# Altium schematic sheet node24-stm32f765bit6.SchDoc: STM32F765BIT6
size Tabloid; Author: Emergence Team; Engineer: asheem; Organization: Emergence; Address1: Oakland, California; Address2: a@aliengeometry.com; Address3: Black Rock City '18; Address4: OPEN SOURCE H/W; DocumentNumber: 2; Revision: Rev 0.1; SheetNumber: 2; SheetTotal: 6; SheetTitle: Node28 Main
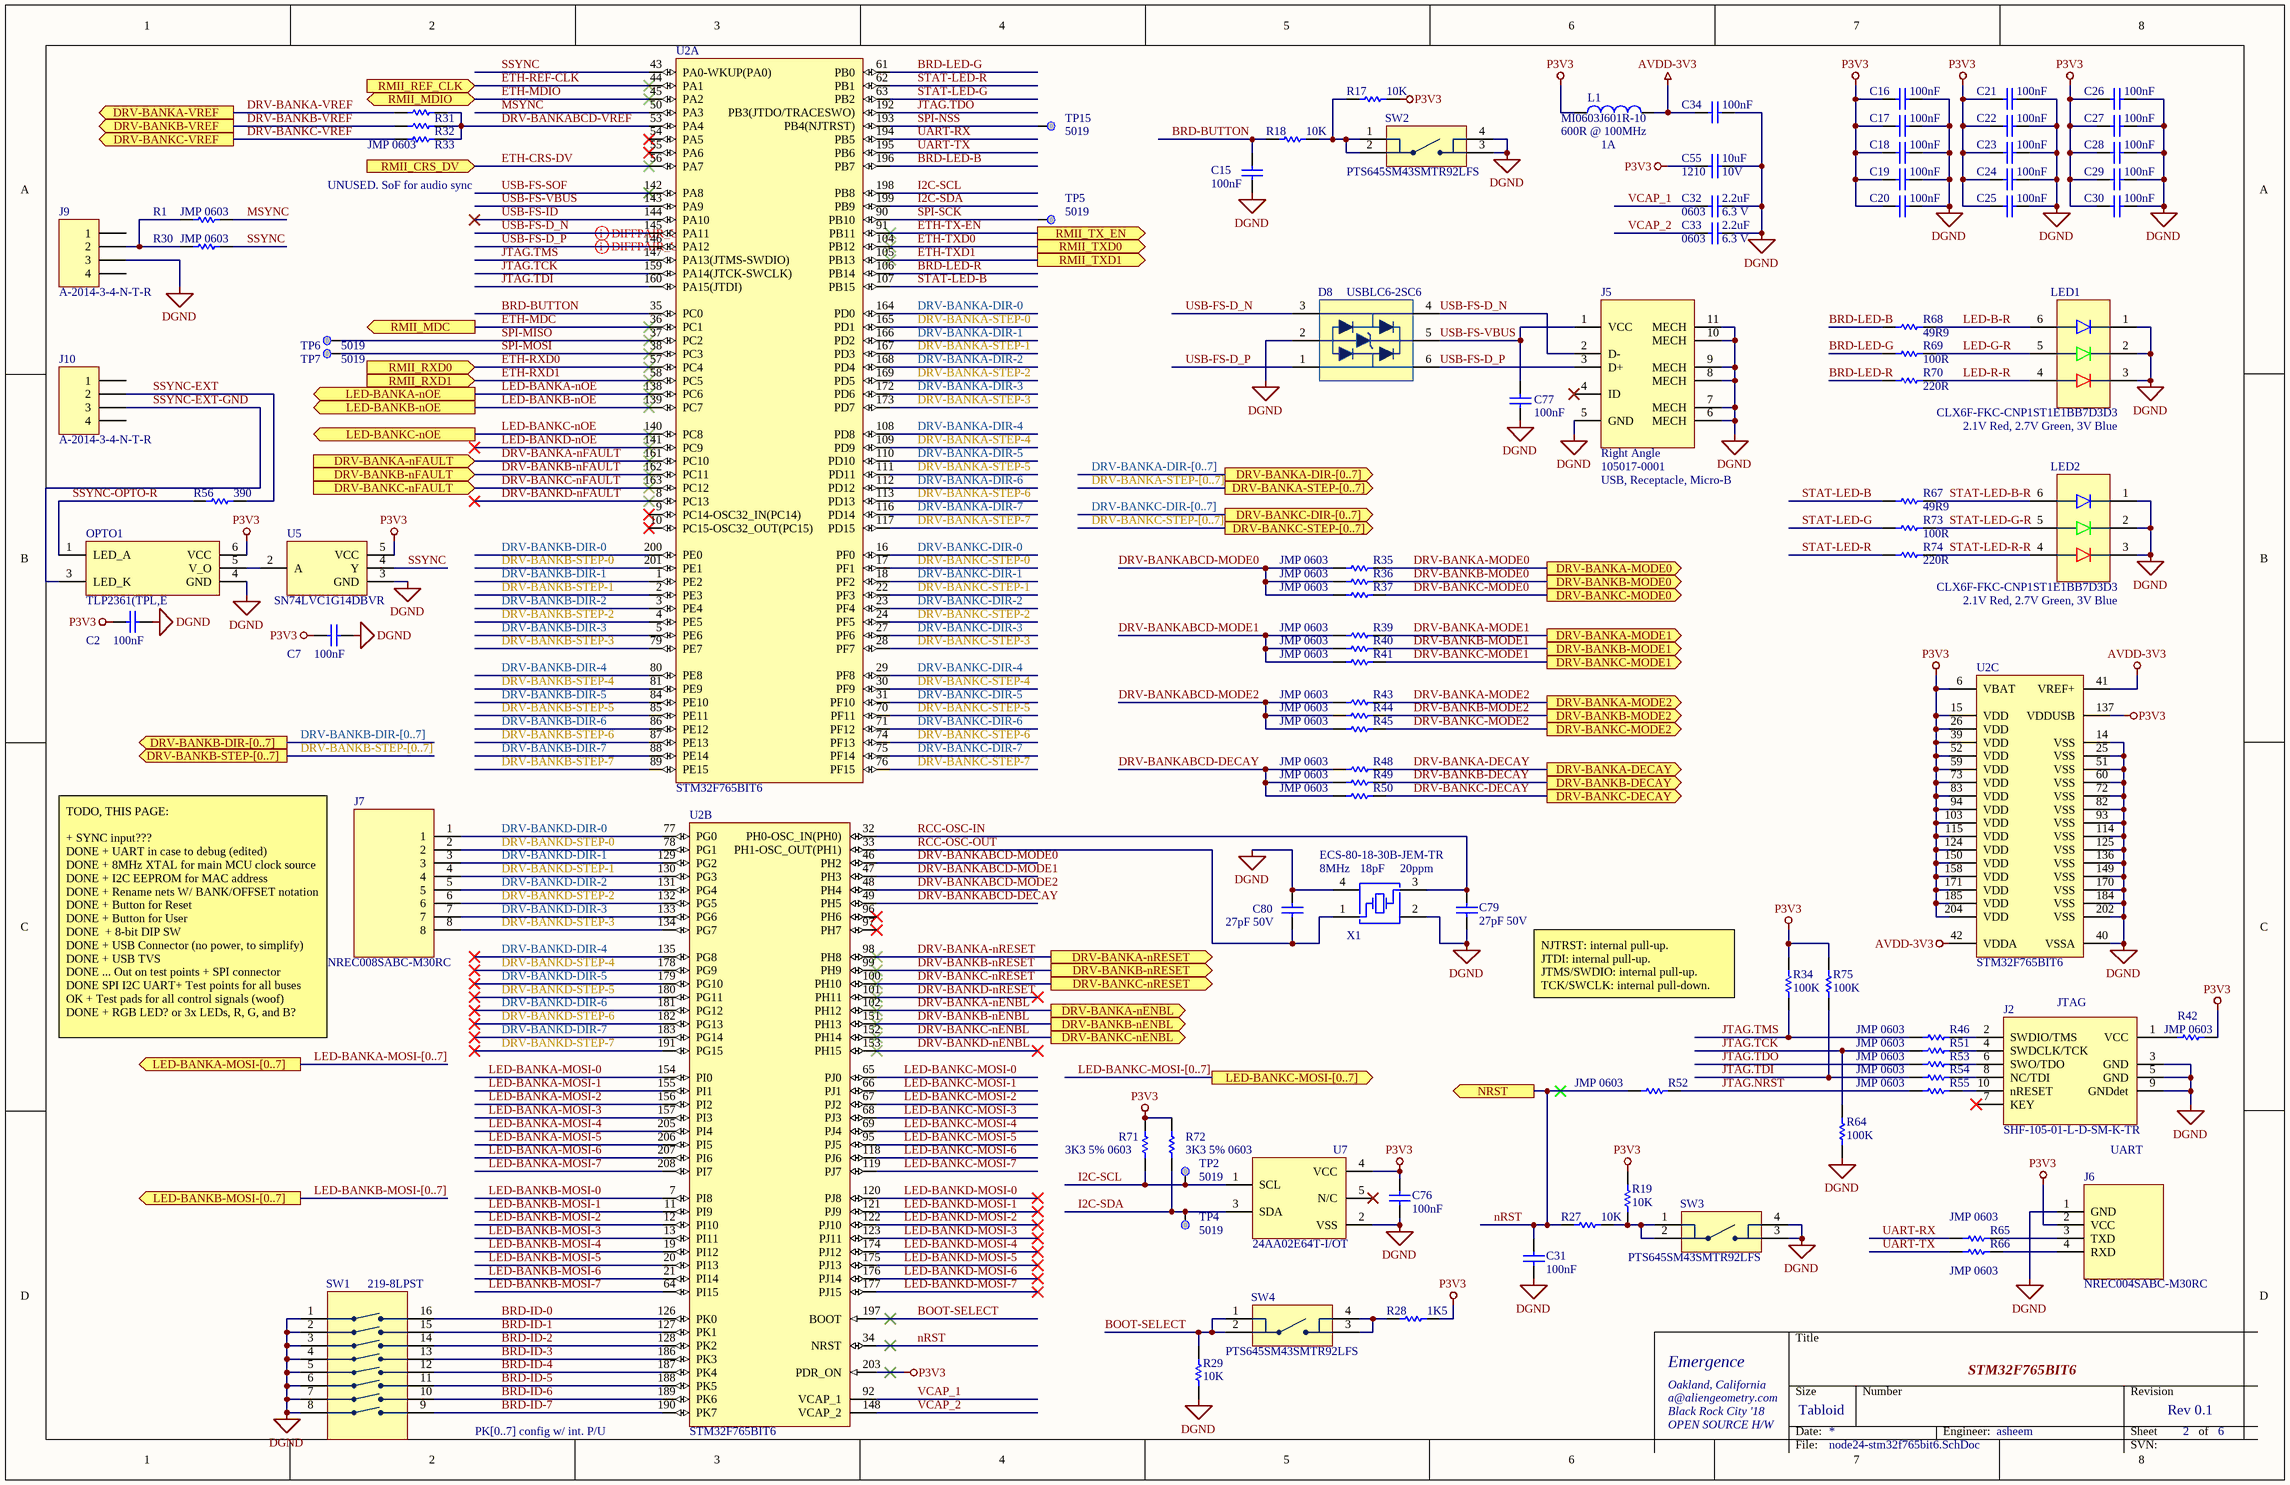
[diagram p0: node24-stm32f765bit6.SchDoc]

## Parts
C2  100nF  [CAPC0603(1608)100_L]
C7  100nF  [CAPC0603(1608)100_L]
C15  100nF  [CAPC0603(1608)100_L]
C16  100nF  [CAPC0603(1608)100_L]
C17  100nF  [CAPC0603(1608)100_L]
C18  100nF  [CAPC0603(1608)100_L]
C19  100nF  [CAPC0603(1608)100_L]
C20  100nF  [CAPC0603(1608)100_L]
C21  100nF  [CAPC0603(1608)100_L]
C22  100nF  [CAPC0603(1608)100_L]
C23  100nF  [CAPC0603(1608)100_L]
C24  100nF  [CAPC0603(1608)100_L]
C25  100nF  [CAPC0603(1608)100_L]
C26  100nF  [CAPC0603(1608)100_L]
C27  100nF  [CAPC0603(1608)100_L]
C28  100nF  [CAPC0603(1608)100_L]
C29  100nF  [CAPC0603(1608)100_L]
C30  100nF  [CAPC0603(1608)100_L]
C31  100nF  [CAPC0603(1608)100_L]
C32  value 2.2uF  Case-EIA: 0603  Rated Voltage: 6.3 V  [CAPC0603(1608)100_M]  (hidden comment: 2.2uF 6.3V)
C33  value 2.2uF  Case-EIA: 0603  Rated Voltage: 6.3 V  [CAPC0603(1608)100_M]  (hidden comment: 2.2uF 6.3V)
C34  100nF  [CAPC0603(1608)100_L]
C55  Capacitance: 10uF  Case/Package: 1210  Voltage Rating: 10V  [1210C]  (hidden comment: CAP_CER_10UF_1210_CL32B106KPINNNE)
C76  100nF  [CAPC0603(1608)100_L]
C77  100nF  [CAPC0603(1608)100_L]
C79  27pF 50V  [CAPC0603(1608)100_L]
C80  27pF 50V  [CAPC0603(1608)100_L]
D8  Manufacturer Part Number: USBLC6-2SC6  [SOT23-6L]  (hidden comment: TVS DIODE 5.25V 17V SOT23-6)
J2  Manufacturer Part Number: SHF-105-01-L-D-SM-K-TR  [CONN_SAMTEC_HDR_50MIL_10POS_SHRD_SM_SHF-105-01-L-D-SM]  (hidden comment: CONN_HDR_2X5_V_M_SM_50MIL_SAMTEC_SHF-105-01-L-D-SM-K-TR)
J5  Orientation: Right Angle  Manufacturer Part Number: 105017-0001  Connector Type: USB, Receptacle, Micro-B  [CONN_MOLEX_USB_MICRO_B_SMD_RA_1050170001]  (hidden comment: CONN_USB_MICRO-B_RA_SMD_MOLEX_105017-0001)
J6  Manufacturer Part Number: NREC004SABC-M30RC  [HDR_1X4_2R54_V_M_SMT]  (hidden comment: CONN_HDR_1X4_V_SMT_NREC004SABC-M30RC)
J7  Manufacturer Part Number: NREC008SABC-M30RC  [HDR_1X8_2R54_V_M_SMT]  (hidden comment: CONN_HDR_1X8_V_M_SMT_NREC008SABC-M30RC)
J9  Manufacturer Part Number: A-2014-3-4-N-T-R  [CON_JACK_MOD_4P4C_ASSMANN_A-2014-3-4-N-T-R]  (hidden comment: CONN_ASSMANN_JACK_MOD_4P4C_A-2014-3-4-N-T-R)
J10  Manufacturer Part Number: A-2014-3-4-N-T-R  [CON_JACK_MOD_4P4C_ASSMANN_A-2014-3-4-N-T-R]  (hidden comment: CONN_ASSMANN_JACK_MOD_4P4C_A-2014-3-4-N-T-R)
L1  Manufacturer Part Number: MI0603J601R-10  Max DC Current: 1A  Impedance: 600R @ 100MHz  [0603L]  (hidden comment: BEAD_LAIRD_MI0603J601R-10)
LED1  Forward Voltage: 2.1V Red, 2.7V Green, 3V Blue  Manufacturer Part Number: CLX6F-FKC-CNP1ST1E1BB7D3D3  [LED_6PLCC_RGB]  (hidden comment: LED_RGB_SMD_CLX6F-FKC-CNP1ST1E1BB7D3D3)
LED2  Forward Voltage: 2.1V Red, 2.7V Green, 3V Blue  Manufacturer Part Number: CLX6F-FKC-CNP1ST1E1BB7D3D3  [LED_6PLCC_RGB]  (hidden comment: LED_RGB_SMD_CLX6F-FKC-CNP1ST1E1BB7D3D3)
OPTO1  Manufacturer Part Number: TLP2361(TPL,E  [SO-5]  (hidden comment: OPTO_TOSHIBA_LOGIC_PUSHPULL_TLP2361(TPL,E)
R1  JMP 0603  [RESC0603(1608)_L]
R17  10K  [RESC0603(1608)_L]
R18  10K  [RESC0603(1608)_L]
R19  10K  [RESC0603(1608)_L]
R27  10K  [RESC0603(1608)_L]
R28  1K5  [RESC0603(1608)_L]
R29  10K  [RESC0603(1608)_L]
R30  JMP 0603  [RESC0603(1608)_L]
R31  JMP 0603  [RESC0603(1608)_L]
R32  JMP 0603  [RESC0603(1608)_L]  (value not drawn)
R33  JMP 0603  [RESC0603(1608)_L]  (value not drawn)
R34  100K  [RESC0603(1608)_L]
R35  JMP 0603  [RESC0603(1608)_L]
R36  JMP 0603  [RESC0603(1608)_L]
R37  JMP 0603  [RESC0603(1608)_L]
R39  JMP 0603  [RESC0603(1608)_L]
R40  JMP 0603  [RESC0603(1608)_L]
R41  JMP 0603  [RESC0603(1608)_L]
R42  JMP 0603  [RESC0603(1608)_L]
R43  JMP 0603  [RESC0603(1608)_L]
R44  JMP 0603  [RESC0603(1608)_L]
R45  JMP 0603  [RESC0603(1608)_L]
R46  JMP 0603  [RESC0603(1608)_L]
R48  JMP 0603  [RESC0603(1608)_L]
R49  JMP 0603  [RESC0603(1608)_L]
R50  JMP 0603  [RESC0603(1608)_L]
R51  JMP 0603  [RESC0603(1608)_L]
R52  JMP 0603  [RESC0603(1608)_L]
R53  JMP 0603  [RESC0603(1608)_L]
R54  JMP 0603  [RESC0603(1608)_L]
R55  JMP 0603  [RESC0603(1608)_L]
R56  value 390  [RESC0603(1608)_L]  (hidden comment: 390R 1% 0603(1608))
R64  100K  [RESC0603(1608)_L]
R65  JMP 0603  [RESC0603(1608)_L]
R66  JMP 0603  [RESC0603(1608)_L]
R67  49R9  [RESC0603(1608)_L]
R68  49R9  [RESC0603(1608)_L]
R69  100R  [RESC0603(1608)_L]
R70  220R  [RESC0603(1608)_L]
R71  3K3 5% 0603  [RESC0603(1608)_L]
R72  3K3 5% 0603  [RESC0603(1608)_L]
R73  100R  [RESC0603(1608)_L]
R74  220R  [RESC0603(1608)_L]
R75  100K  [RESC0603(1608)_L]
SW1  Manufacturer Part Number: 219-8LPST  [SWITCH_DIP_CTS_8-BIT_219-8LPST]  (hidden comment: SWITCH_CTS_DIP_8BIT_SMD_219-8LPST)
SW2  Manufacturer Part Number: PTS645SM43SMTR92LFS  [SWITCH_CK_TACT_PTS645SM43SMTR92]  (hidden comment: SWITCH_CK_TACTILE_SPST_SMD_PTS645SM43SMTR92LFS)
SW3  Manufacturer Part Number: PTS645SM43SMTR92LFS  [SWITCH_CK_TACT_PTS645SM43SMTR92]  (hidden comment: SWITCH_CK_TACTILE_SPST_SMD_PTS645SM43SMTR92LFS)
SW4  Manufacturer Part Number: PTS645SM43SMTR92LFS  [SWITCH_CK_TACT_PTS645SM43SMTR92]  (hidden comment: SWITCH_CK_TACTILE_SPST_SMD_PTS645SM43SMTR92LFS)
TP2  Manufacturer Part Number: 5019  [TEST_POINT_KEYSTONE_5019]  (hidden comment: TEST_POINT_KEYSTONE_5019_SMT)
TP4  Manufacturer Part Number: 5019  [TEST_POINT_KEYSTONE_5019]  (hidden comment: TEST_POINT_KEYSTONE_5019_SMT)
TP5  Manufacturer Part Number: 5019  [TEST_POINT_KEYSTONE_5019]  (hidden comment: TEST_POINT_KEYSTONE_5019_SMT)
TP6  Manufacturer Part Number: 5019  [TEST_POINT_KEYSTONE_5019]  (hidden comment: TEST_POINT_KEYSTONE_5019_SMT)
TP7  Manufacturer Part Number: 5019  [TEST_POINT_KEYSTONE_5019]  (hidden comment: TEST_POINT_KEYSTONE_5019_SMT)
TP15  Manufacturer Part Number: 5019  [TEST_POINT_KEYSTONE_5019]  (hidden comment: TEST_POINT_KEYSTONE_5019_SMT)
U2  STM32F765BIT6  [QFP208L_B28X28_P0MM5]  (parts A,B,C of 3)
U5  Manufacturer Part Number: SN74LVC1G14DBVR  [SOT-23-5L]  (hidden comment: LOGIC_INVERTER_SN74LVC1G14DBVR)
U7  Manufacturer Part Number: 24AA02E64T-I/OT  [SOT-23-5L]  (hidden comment: IC EEPROM 2K I2C 400KHZ SOT23-5)
X1  Load Capacitance: 18pF  Frequency Tolerance: 20ppm  Frequency: 8MHz  Manufacturer Part Number: ECS-80-18-30B-JEM-TR  [XTAL_4SMD_5x3mm2]  (hidden comment: XTAL_8MHz_4SMD_18PF_20PPM_ECS-80-18-30B-JEM-TR)

## Ports
DRV-BANKA-DECAY (out), DRV-BANKA-DIR-[0..7] (out), DRV-BANKA-MODE0 (out), DRV-BANKA-MODE1 (out), DRV-BANKA-MODE2 (out), DRV-BANKA-nENBL (out), DRV-BANKA-nFAULT (in), DRV-BANKA-nRESET (out), DRV-BANKA-STEP-[0..7] (out), DRV-BANKA-VREF (out), DRV-BANKB-DECAY (out), DRV-BANKB-DIR-[0..7] (out), DRV-BANKB-MODE0 (out), DRV-BANKB-MODE1 (out), DRV-BANKB-MODE2 (out), DRV-BANKB-nENBL (out), DRV-BANKB-nFAULT (in), DRV-BANKB-nRESET (out), DRV-BANKB-STEP-[0..7] (out), DRV-BANKB-VREF (out), DRV-BANKC-DECAY (out), DRV-BANKC-DIR-[0..7] (out), DRV-BANKC-MODE0 (out), DRV-BANKC-MODE1 (out), DRV-BANKC-MODE2 (out), DRV-BANKC-nENBL (out), DRV-BANKC-nFAULT (in), DRV-BANKC-nRESET (out), DRV-BANKC-STEP-[0..7] (out), DRV-BANKC-VREF (out), LED-BANKA-MOSI-[0..7] (out), LED-BANKA-nOE (out), LED-BANKB-MOSI-[0..7] (out), LED-BANKB-nOE (out), LED-BANKC-MOSI-[0..7] (out), LED-BANKC-nOE (out), NRST (out), RMII_CRS_DV (in), RMII_MDC (out), RMII_MDIO (bidir), RMII_REF_CLK (in), RMII_RXD0 (in), RMII_RXD1 (in), RMII_TX_EN (out), RMII_TXD0 (out), RMII_TXD1 (out)

## Nets
AVDD-3V3: C34.1 L1.2 U2.41(VREF+) U2.42(VDDA)
DGND: C2.2 C7.2 C15.1 C16.2 C17.2 C18.2 C19.2 C20.2 C21.2 C22.2 C23.2 C24.2 C25.2 C26.2 C27.2 C28.2 C29.2 C30.2 C31.1 C32.2 C33.2 C34.2 C55.2 C76.2 C77.2 C79.2 C80.1 D8.2 J2.3(GND) J2.5(GND) J2.9(GNDdet) J5.5(GND) J5.6(MECH) J5.7(MECH) J5.8(MECH) J5.9(MECH) J5.10(MECH) J5.11(MECH) J6.1(GND) J9.3 LED1.1 LED1.2 LED1.3 LED2.1 LED2.2 LED2.3 OPTO1.4(GND) R29.1 R64.1 SW1.1 SW1.2 SW1.3 SW1.4 SW1.5 SW1.6 SW1.7 SW1.8 SW2.3 SW2.4 SW3.3 SW3.4 U2.14(VSS) U2.25(VSS) U2.40(VSSA) U2.51(VSS) U2.60(VSS) U2.72(VSS) U2.82(VSS) U2.93(VSS) U2.114(VSS) U2.125(VSS) U2.136(VSS) U2.149(VSS) U2.170(VSS) U2.184(VSS) U2.202(VSS) U5.3(GND) U7.2(VSS) X1.2(CAN) X1.4(CAN)
P3V3: C2.1 C7.1 C16.1 C17.1 C18.1 C19.1 C20.1 C21.1 C22.1 C23.1 C24.1 C25.1 C26.1 C27.1 C28.1 C29.1 C30.1 C55.1 C76.1 J6.2(VCC) L1.1 OPTO1.6(VCC) R17.2 R19.2 R28.2 R34.2 R42.2 R71.2 R72.2 R75.2 U2.6(VBAT) U2.15(VDD) U2.26(VDD) U2.39(VDD) U2.52(VDD) U2.59(VDD) U2.73(VDD) U2.83(VDD) U2.94(VDD) U2.103(VDD) U2.115(VDD) U2.124(VDD) U2.137(VDDUSB) U2.150(VDD) U2.158(VDD) U2.171(VDD) U2.185(VDD) U2.203(PDR_ON) U2.204(VDD) U5.5(VCC) U7.4(VCC)
BOOT-SELECT: R29.2 SW4.1 SW4.2 U2.197(BOOT)
BRD-BUTTON: C15.2 R18.1 U2.35(PC0)
BRD-ID-0: SW1.16 U2.126(PK0)
BRD-ID-1: SW1.15 U2.127(PK1)
BRD-ID-2: SW1.14 U2.128(PK2)
BRD-ID-3: SW1.13 U2.186(PK3)
BRD-ID-4: SW1.12 U2.187(PK4)
BRD-ID-5: SW1.11 U2.188(PK5)
BRD-ID-6: SW1.10 U2.189(PK6)
BRD-ID-7: SW1.9 U2.190(PK7)
BRD-LED-B: R68.2 U2.196(PB7)
BRD-LED-G: R69.1 U2.61(PB0)
BRD-LED-R: R70.2 U2.106(PB14)
DRV-BANKA-DECAY: R48.2 ; port DRV-BANKA-DECAY
DRV-BANKA-DIR-0: U2.164(PD0)
DRV-BANKA-DIR-1: U2.166(PD2)
DRV-BANKA-DIR-2: U2.168(PD4)
DRV-BANKA-DIR-3: U2.172(PD6)
DRV-BANKA-DIR-4: U2.108(PD8)
DRV-BANKA-DIR-5: U2.110(PD10)
DRV-BANKA-DIR-6: U2.112(PD12)
DRV-BANKA-DIR-7: U2.116(PD14)
DRV-BANKA-MODE0: R35.2 ; port DRV-BANKA-MODE0
DRV-BANKA-MODE1: R39.2 ; port DRV-BANKA-MODE1
DRV-BANKA-MODE2: R43.2 ; port DRV-BANKA-MODE2
DRV-BANKA-nENBL: U2.102(PH12) ; port DRV-BANKA-nENBL
DRV-BANKA-nFAULT: U2.161(PC10) ; port DRV-BANKA-nFAULT
DRV-BANKA-nRESET: U2.98(PH8) ; port DRV-BANKA-nRESET
DRV-BANKA-STEP-0: U2.165(PD1)
DRV-BANKA-STEP-1: U2.167(PD3)
DRV-BANKA-STEP-2: U2.169(PD5)
DRV-BANKA-STEP-3: U2.173(PD7)
DRV-BANKA-STEP-4: U2.109(PD9)
DRV-BANKA-STEP-5: U2.111(PD11)
DRV-BANKA-STEP-6: U2.113(PD13)
DRV-BANKA-STEP-7: U2.117(PD15)
DRV-BANKA-VREF: R31.1 ; port DRV-BANKA-VREF
DRV-BANKABCD-DECAY: R48.1 R49.1 R50.1 U2.49(PH5)
DRV-BANKABCD-MODE0: R35.1 R36.1 R37.1 U2.46(PH2)
DRV-BANKABCD-MODE1: R39.1 R40.1 R41.1 U2.47(PH3)
DRV-BANKABCD-MODE2: R43.1 R44.1 R45.1 U2.48(PH4)
DRV-BANKABCD-VREF: R31.2 R32.2 R33.2 U2.53(PA4)
DRV-BANKB-DECAY: R49.2 ; port DRV-BANKB-DECAY
DRV-BANKB-DIR-0: U2.200(PE0)
DRV-BANKB-DIR-1: U2.1(PE2)
DRV-BANKB-DIR-2: U2.3(PE4)
DRV-BANKB-DIR-3: U2.5(PE6)
DRV-BANKB-DIR-4: U2.80(PE8)
DRV-BANKB-DIR-5: U2.84(PE10)
DRV-BANKB-DIR-6: U2.86(PE12)
DRV-BANKB-DIR-7: U2.88(PE14)
DRV-BANKB-MODE0: R36.2 ; port DRV-BANKB-MODE0
DRV-BANKB-MODE1: R40.2 ; port DRV-BANKB-MODE1
DRV-BANKB-MODE2: R44.2 ; port DRV-BANKB-MODE2
DRV-BANKB-nENBL: U2.151(PH13) ; port DRV-BANKB-nENBL
DRV-BANKB-nFAULT: U2.162(PC11) ; port DRV-BANKB-nFAULT
DRV-BANKB-nRESET: U2.99(PH9) ; port DRV-BANKB-nRESET
DRV-BANKB-STEP-0: U2.201(PE1)
DRV-BANKB-STEP-1: U2.2(PE3)
DRV-BANKB-STEP-2: U2.4(PE5)
DRV-BANKB-STEP-3: U2.79(PE7)
DRV-BANKB-STEP-4: U2.81(PE9)
DRV-BANKB-STEP-5: U2.85(PE11)
DRV-BANKB-STEP-6: U2.87(PE13)
DRV-BANKB-STEP-7: U2.89(PE15)
DRV-BANKB-VREF: R32.1 ; port DRV-BANKB-VREF
DRV-BANKC-DECAY: R50.2 ; port DRV-BANKC-DECAY
DRV-BANKC-DIR-0: U2.16(PF0)
DRV-BANKC-DIR-1: U2.18(PF2)
DRV-BANKC-DIR-2: U2.23(PF4)
DRV-BANKC-DIR-3: U2.27(PF6)
DRV-BANKC-DIR-4: U2.29(PF8)
DRV-BANKC-DIR-5: U2.31(PF10)
DRV-BANKC-DIR-6: U2.71(PF12)
DRV-BANKC-DIR-7: U2.75(PF14)
DRV-BANKC-MODE0: R37.2 ; port DRV-BANKC-MODE0
DRV-BANKC-MODE1: R41.2 ; port DRV-BANKC-MODE1
DRV-BANKC-MODE2: R45.2 ; port DRV-BANKC-MODE2
DRV-BANKC-nENBL: U2.152(PH14) ; port DRV-BANKC-nENBL
DRV-BANKC-nFAULT: U2.163(PC12) ; port DRV-BANKC-nFAULT
DRV-BANKC-nRESET: U2.100(PH10) ; port DRV-BANKC-nRESET
DRV-BANKC-STEP-0: U2.17(PF1)
DRV-BANKC-STEP-1: U2.22(PF3)
DRV-BANKC-STEP-2: U2.24(PF5)
DRV-BANKC-STEP-3: U2.28(PF7)
DRV-BANKC-STEP-4: U2.30(PF9)
DRV-BANKC-STEP-5: U2.70(PF11)
DRV-BANKC-STEP-6: U2.74(PF13)
DRV-BANKC-STEP-7: U2.76(PF15)
DRV-BANKC-VREF: R33.1 ; port DRV-BANKC-VREF
DRV-BANKD-DIR-0: J7.1 U2.77(PG0)
DRV-BANKD-DIR-1: J7.3 U2.129(PG2)
DRV-BANKD-DIR-2: J7.5 U2.131(PG4)
DRV-BANKD-DIR-3: J7.7 U2.133(PG6)
DRV-BANKD-DIR-4: U2.135(PG8)
DRV-BANKD-DIR-5: U2.179(PG10)
DRV-BANKD-DIR-6: U2.181(PG12)
DRV-BANKD-DIR-7: U2.183(PG14)
DRV-BANKD-nENBL: U2.153(PH15)
DRV-BANKD-nFAULT: U2.8(PC13)
DRV-BANKD-nRESET: U2.101(PH11)
DRV-BANKD-STEP-0: J7.2 U2.78(PG1)
DRV-BANKD-STEP-1: J7.4 U2.130(PG3)
DRV-BANKD-STEP-2: J7.6 U2.132(PG5)
DRV-BANKD-STEP-3: J7.8 U2.134(PG7)
DRV-BANKD-STEP-4: U2.178(PG9)
DRV-BANKD-STEP-5: U2.180(PG11)
DRV-BANKD-STEP-6: U2.182(PG13)
DRV-BANKD-STEP-7: U2.191(PG15)
ETH-CRS-DV: U2.56(PA7) ; port RMII_CRS_DV
ETH-MDC: U2.36(PC1) ; port RMII_MDC
ETH-MDIO: U2.45(PA2) ; port RMII_MDIO
ETH-REF-CLK: U2.44(PA1) ; port RMII_REF_CLK
ETH-RXD0: U2.57(PC4) ; port RMII_RXD0
ETH-RXD1: U2.58(PC5) ; port RMII_RXD1
ETH-TX-EN: U2.91(PB11) ; port RMII_TX_EN
ETH-TXD0: U2.104(PB12) ; port RMII_TXD0
ETH-TXD1: U2.105(PB13) ; port RMII_TXD1
I2C-SCL: R71.1 TP2.1 U2.198(PB8) U7.1(SCL)
I2C-SDA: R72.1 TP4.1 U2.199(PB9) U7.3(SDA)
JTAG.NRST: R52.2 R55.1
JTAG.TCK: R51.1 R64.2 U2.159(PA14(JTCK-SWCLK))
JTAG.TDI: R54.1 R75.1 U2.160(PA15(JTDI))
JTAG.TDO: R53.1 U2.192(PB3(JTDO/TRACESWO))
JTAG.TMS: R34.1 R46.1 U2.147(PA13(JTMS-SWDIO))
LED-B-R: LED1.6 R68.1
LED-BANKA-MOSI-0: U2.154(PI0)
LED-BANKA-MOSI-1: U2.155(PI1)
LED-BANKA-MOSI-2: U2.156(PI2)
LED-BANKA-MOSI-3: U2.157(PI3)
LED-BANKA-MOSI-4: U2.205(PI4)
LED-BANKA-MOSI-5: U2.206(PI5)
LED-BANKA-MOSI-6: U2.207(PI6)
LED-BANKA-MOSI-7: U2.208(PI7)
LED-BANKA-nOE: U2.138(PC6) ; port LED-BANKA-nOE
LED-BANKB-MOSI-0: U2.7(PI8)
LED-BANKB-MOSI-1: U2.11(PI9)
LED-BANKB-MOSI-2: U2.12(PI10)
LED-BANKB-MOSI-3: U2.13(PI11)
LED-BANKB-MOSI-4: U2.19(PI12)
LED-BANKB-MOSI-5: U2.20(PI13)
LED-BANKB-MOSI-6: U2.21(PI14)
LED-BANKB-MOSI-7: U2.64(PI15)
LED-BANKB-nOE: U2.139(PC7) ; port LED-BANKB-nOE
LED-BANKC-MOSI-0: U2.65(PJ0)
LED-BANKC-MOSI-1: U2.66(PJ1)
LED-BANKC-MOSI-2: U2.67(PJ2)
LED-BANKC-MOSI-3: U2.68(PJ3)
LED-BANKC-MOSI-4: U2.69(PJ4)
LED-BANKC-MOSI-5: U2.95(PJ5)
LED-BANKC-MOSI-6: U2.118(PJ6)
LED-BANKC-MOSI-7: U2.119(PJ7)
LED-BANKC-nOE: U2.140(PC8) ; port LED-BANKC-nOE
LED-BANKD-MOSI-0: U2.120(PJ8)
LED-BANKD-MOSI-1: U2.121(PJ9)
LED-BANKD-MOSI-2: U2.122(PJ10)
LED-BANKD-MOSI-3: U2.123(PJ11)
LED-BANKD-MOSI-4: U2.174(PJ12)
LED-BANKD-MOSI-5: U2.175(PJ13)
LED-BANKD-MOSI-6: U2.176(PJ14)
LED-BANKD-MOSI-7: U2.177(PJ15)
LED-BANKD-nOE: U2.141(PC9)
LED-G-R: LED1.5 R69.2
LED-R-R: LED1.4 R70.1
MSYNC: R1.2 U2.50(PA3)
nRST: C31.2 R27.1 R52.1 U2.34(NRST) ; port NRST
RCC-OSC-IN: C79.1 U2.32(PH0-OSC_IN(PH0)) X1.3
RCC-OSC-OUT: C80.2 U2.33(PH1-OSC_OUT(PH1)) X1.1(OSC1)
SPI-MISO: TP6.1 U2.37(PC2)
SPI-MOSI: TP7.1 U2.38(PC3)
SPI-NSS: TP15.1 U2.193(PB4(NJTRST))
SPI-SCK: TP5.1 U2.90(PB10)
SSYNC: R30.2 U2.43(PA0-WKUP(PA0)) U5.4(Y)
SSYNC-EXT: J10.2 R56.2
SSYNC-EXT-GND: J10.3 OPTO1.3(LED_K)
SSYNC-OPTO-R: OPTO1.1(LED_A) R56.1
STAT-LED-B: R67.2 U2.107(PB15)
STAT-LED-B-R: LED2.6 R67.1
STAT-LED-G: R73.1 U2.63(PB2)
STAT-LED-G-R: LED2.5 R73.2
STAT-LED-R: R74.2 U2.62(PB1)
STAT-LED-R-R: LED2.4 R74.1
UART-RX: R65.1 U2.194(PB5)
UART-TX: R66.1 U2.195(PB6)
USB-FS-D_N: D8.3 D8.4 J5.2(D-) U2.145(PA11)
USB-FS-D_P: D8.1 D8.6 J5.3(D+) U2.146(PA12)
USB-FS-ID: U2.144(PA10)
USB-FS-SOF: U2.142(PA8)
USB-FS-VBUS: C77.1 D8.5 J5.1(VCC) U2.143(PA9)
VCAP_1: C32.1 U2.92(VCAP_1)
VCAP_2: C33.1 U2.148(VCAP_2)
NetJ2_1: J2.1(VCC) R42.1
NetJ2_2: J2.2(SWDIO/TMS) R46.2
NetJ2_4: J2.4(SWDCLK/TCK) R51.2
NetJ2_6: J2.6(SWO/TDO) R53.2
NetJ2_8: J2.8(NC/TDI) R54.2
NetJ2_10: J2.10(nRESET) R55.2
NetJ6_3: J6.3(TXD) R65.2
NetJ6_4: J6.4(RXD) R66.2
NetJ9_2: J9.2 R1.1 R30.1
NetOPTO1_5: OPTO1.5(V_O) U5.2(A)
NetR17_1: R17.1 R18.2 SW2.1 SW2.2
NetR19_1: R19.1 R27.2 SW3.1 SW3.2
NetR28_1: R28.1 SW4.3 SW4.4

Not connected (* = marked no-connect by the designer): J2 7(KEY)*; J5 4(ID)*; J9 1 4; J10 1 4; U2 9(PC14-OSC32_IN(PC14))* 10(PC15-OSC32_OUT(PC15))* 54(PA5)* 55(PA6)* 96(PH6)* 97(PH7)*; U5 1(N/C); U7 5(N/C)*

## Buses and harness runs
bus DRV-BANKA-DIR-[0..7] = port DRV-BANKA-DIR-[0..7]
bus DRV-BANKA-STEP-[0..7] = port DRV-BANKA-STEP-[0..7]
bus DRV-BANKB-DIR-[0..7] = port DRV-BANKB-DIR-[0..7]
bus DRV-BANKB-STEP-[0..7] = port DRV-BANKB-STEP-[0..7]
bus DRV-BANKC-DIR-[0..7] = port DRV-BANKC-DIR-[0..7]
bus DRV-BANKC-STEP-[0..7] = port DRV-BANKC-STEP-[0..7]
bus LED-BANKA-MOSI-[0..7] = port LED-BANKA-MOSI-[0..7]
bus LED-BANKB-MOSI-[0..7] = port LED-BANKB-MOSI-[0..7]
bus LED-BANKC-MOSI-[0..7] = port LED-BANKC-MOSI-[0..7]

## Layout directives
differential pair: USB-FS-D_N, USB-FS-D_P

## Notes on the sheet
- UNUSED. SoF for audio sync
- TODO, THIS PAGE:
  + SYNC input???
  DONE + UART in case to debug (edited)
  DONE + 8MHz XTAL for main MCU clock source
  DONE + I2C EEPROM for MAC address
  DONE + Rename nets W/ BANK/OFFSET notation
  DONE + Button for Reset
  DONE + Button for User
  DONE  + 8-bit DIP SW
  DONE + USB Connector (no power, to simplify)
  DONE + USB TVS
  DONE ... Out on test points + SPI connector
  DONE SPI I2C UART+ Test points for all buses
  OK + Test pads for all control signals (woof)
  DONE + RGB LED? or 3x LEDs, R, G, and B?
- NJTRST: internal pull-up.
  JTDI: internal pull-up.
  JTMS/SWDIO: internal pull-up.
  TCK/SWCLK: internal pull-down.
- (near J2) JTAG
- UART
- PK[0..7] config w/ int. P/U
- Title
- Size
- Date:
- Tabloid
- Number
- Engineer:
- Revision
- Sheet
- of
- File:
- SVN:

## Library data of the parts
C2 C7 C15-C31 C34 C76 C77 = CMP-1035-02593-1: CAP 100nF 50V ±20% 0603 (1608 Metric) Thickness 1mm SMD; Tolerance: Â±20%; Case-EIA: 0603; Case-Metric: 1608; Max Thickness: 1 mm; Value: 100nF; Technology: SMT; Rated Voltage: 50 V
C32 C33 = CMP-1035-02755-1: CAP 2.2uF 6.3V ±20% 0603 (1608 Metric) Thickness 1mm SMD; Tolerance: Â±20%; Case-Metric: 1608; Technology: SMT; Max Thickness: 1 mm
C55 = CAP_CER_10UF_1210_CL32B106KPINNNE: Cap Ceramic 10uF 10V X7R 10% SMD 1210 125C Embossed T/R; Manufacturer: Samsung; Supplier 1: Digi-Key; Manufacturer Part Number: CL32B106KPINNNE; Stock 1: 13080; Pricing 1: 1=0.36, 10=0.252, 100=0.1509, 500=0.1132, 1000=0.09559 (USD); Mount: Surface Mount; Case Code (Metric): 3225; Case Code (Imperial): 1210; Min Operating Temperature: -55°C; Max Operating Temperature: 125°C; Tolerance: 10%; Dielectric: X7R; Package Quantity: 2000; Packaging: Tape and Reel; Voltage Rating (DC): 10V; Length: 3.2mm; Height: 2mm; Depth: 2.5mm; Width: 0.098inch; Thickness: 0.087inch; Radiation Hardening: No; Lead Free: Lead Free; ComponentLink1URL: https://datasheet.ciiva.com/25792/cl32b106kpinnne-25792065.pdf; ComponentLink1Description: https://datasheet.ciiva.com/25792/cl32b106kpinnne-25792065.pdf; ComponentLink2URL: https://datasheet.ciiva.com/16437/cl05b104kq5nnnc-16437173.pdf; ComponentLink2Description: https://datasheet.ciiva.com/16437/cl05b104kq5nnnc-16437173.pdf; Supplier Part Number 1: 1276-3326-6-ND
C79 C80 = CMP-1035-00888-1: CAP 27pF 50V ±5% 0603 (1608 Metric) Thickness 1mm SMD; Case-Metric: 1608; Case-EIA: 0603; Tolerance: Â±5%; Technology: SMT; Value: 27pF; Rated Voltage: 50 V; Max Thickness: 1 mm
D8 = TVS_5.25_USB_ST_USBLC6-2SC6: TVS DIODE 5.25VWM 17VC SOT23-6; Manufacturer: STMicroelectronics; Direction: Unidirectional,Bidirectional; Capacitance: 3.5pF; Operating Supply Voltage: 1.1V; Number of Channels: 2; Breakdown Voltage: 6V; Power Line Protection: Yes; Test Current: 1mA; Max Reverse Leakage Current: 150nA; Peak Pulse Current: 5A; Element Configuration: Dual; Data Rate: 480Mbps; Number of Elements: 1; Working Voltage: 5V; Reverse Breakdown Voltage: V_bkd = 6V; Supplier 1: Digi-Key; Stock 1: 63718; Pricing 1: 1=0.49, 10=0.419, 100=0.3131, 500=0.24602, 1000=0.1901 (USD); Mount: Surface Mount; Case/Package: SOT-23; Number of Pins: 6; Contact Plating: Tin,Matte; Min Operating Temperature: -40°C; Max Operating Temperature: 125°C; Clamping Voltage: 17V; Packaging: Tape and Reel; Package Quantity: 3000; Termination: SMD/SMT; Number of Bidirectional Channels: 2; Min Breakdown Voltage: 6V; ESD Protection: Yes; Leakage Current: 150nA; Polarity: Unidirectional,Bidirectional; Max Breakdown Voltage: 6V; Length: 3.05mm; Height: 1.3mm; Width: 1.75mm; Depth: 1.75mm; Radiation Hardening: No; REACH SVHC: No SVHC; Lead Free: Lead Free; ComponentLink1URL: https://datasheet.ciiva.com/1268/1690354-1268384.pdf; ComponentLink1Description: https://datasheet.ciiva.com/1268/1690354-1268384.pdf; ComponentLink2URL: https://datasheet.ciiva.com/4508/cd00050750-113117-4508433.pdf; ComponentLink2Description: https://datasheet.ciiva.com/4508/cd00050750-113117-4508433.pdf; ComponentLink3URL: https://datasheet.ciiva.com/16200/cd00050750-16200026.pdf; ComponentLink3Description: https://datasheet.ciiva.com/16200/cd00050750-16200026.pdf; ComponentLink4URL: https://datasheet.ciiva.com/15143/getdatasheetpartid-148465-15143789.pdf; ComponentLink4Description: https://datasheet.ciiva.com/15143/getdatasheetpartid-148465-15143789.pdf; ComponentLink5URL: https://datasheet.ciiva.com/26787/usblc6-2sc6-26787908.pdf; ComponentLink5Description: https://datasheet.ciiva.com/26787/usblc6-2sc6-26787908.pdf; ComponentLink6URL: https://datasheet.ciiva.com/41444/001184109-da-01-en-ic-esd-protecti-usblc6-2sc6-sot-23-6-stm-41444156.pdf; ComponentLink6Description: https://datasheet.ciiva.com/41444/001184109-da-01-en-ic-esd-protecti-usblc6-2sc6-sot-23-6-stm-41444156.pdf; Supplier Part Number 1: 497-5235-6-ND; Reverse Standoff Voltage: 5.25V
J2 = CONN_HDR_2X5_V_M_SM_50MIL_SAMTEC_SHF-105-01-L-D-SM-K-TR: Conn Shrouded Header HDR 10 POS 1.27mm Solder ST SMD T/R; Manufacturer: Samtec; Number of Contacts: 10; Gender: Male; Supplier 1: Digi-Key; Stock 1: 106; Pricing 1: 1=3.66, 10=3.511, 100=2.926 (USD); Contact Plating: Nickel,Gold; Contact Material: Bronze; Housing Colour: Black; Housing Material: Polymer; Min Operating Temperature: -55°C; Max Operating Temperature: 125°C; Number of Rows: 2; Packaging: Tape and Reel; Termination: Solder; Orientation: Straight; Length: 12.7mm; Pitch: 1.27mm; Depth: 5.59mm; Radiation Hardening: No; REACH SVHC: No SVHC; ComponentLink1URL: https://datasheet.ciiva.com/16710/eshf-16710342.pdf; ComponentLink1Description: https://datasheet.ciiva.com/16710/eshf-16710342.pdf; ComponentLink2URL: https://datasheet.ciiva.com/10244/eshf-10244043.pdf; ComponentLink2Description: https://datasheet.ciiva.com/10244/eshf-10244043.pdf; ComponentLink3URL: https://datasheet.ciiva.com/25574/1788271-25574734.pdf; ComponentLink3Description: https://datasheet.ciiva.com/25574/1788271-25574734.pdf; Supplier Part Number 1: SAM13249CT-ND
J5 = CONN_USB_MICRO-B_RA_SMD_MOLEX_105017-0001: USB - micro B  Receptacle Connector 5 Position Board Cutout, Surface Mount, Right Angle; Manufacturer: Molex; Max Voltage Rating (AC): 30V; Current Rating: 1.8A; Number of Circuits: 5; USB Standard: USB 2.0; Number of Ports: 1; Pitch: 0.65mm; Supplier 1: Digi-Key; Stock 1: 42814; Pricing 1: 1=0.87, 10=0.763, 25=0.718, 50=0.6882, 100=0.6582, 250=0.5984, 500=0.53856, 1000=0.47872 (USD); Mount: Surface Mount; Contact Plating: Nickel,Gold; Contact Material: Copper,Copper Alloy; Number of Terminals: 5; Housing Material: Polymer; Min Operating Temperature: -20°C; Max Operating Temperature: 85°C; Packaging: Tape and Reel; Gender: Receptacle; Package Quantity: 1; Voltage Rating (AC): 30V; Termination: Solder; Number of Contacts: 5; Voltage Rating: 30V; Number of Positions: 5; Length: 8.2mm; Depth: 7.5mm; Radiation Hardening: No; REACH SVHC: Unknown; Halogen Free: Low Halogen; ComponentLink1URL: https://datasheet.ciiva.com/3094/1050170001-io-connectors-3094416.pdf; ComponentLink1Description: https://datasheet.ciiva.com/3094/1050170001-io-connectors-3094416.pdf; ComponentLink2URL: https://datasheet.ciiva.com/16668/1050170001-io-connectors-16668598.pdf; ComponentLink2Description: https://datasheet.ciiva.com/16668/1050170001-io-connectors-16668598.pdf; ComponentLink3URL: https://datasheet.ciiva.com/4598/1050170001-io-connectors-152207-4598759.pdf; ComponentLink3Description: https://datasheet.ciiva.com/4598/1050170001-io-connectors-152207-4598759.pdf; ComponentLink4URL: https://datasheet.ciiva.com/8015/1631959-8015288.pdf; ComponentLink4Description: https://datasheet.ciiva.com/8015/1631959-8015288.pdf; ComponentLink5URL: https://datasheet.ciiva.com/851/1050170001-sd-851276.pdf; ComponentLink5Description: https://datasheet.ciiva.com/851/1050170001-sd-851276.pdf; ComponentLink6URL: https://datasheet.ciiva.com/5742/1598502-5742508.pdf; ComponentLink6Description: https://datasheet.ciiva.com/5742/1598502-5742508.pdf; ComponentLink7URL: https://datasheet.ciiva.com/22654/1688140-22654924.pdf; ComponentLink7Description: https://datasheet.ciiva.com/22654/1688140-22654924.pdf; ComponentLink8URL: https://datasheet.ciiva.com/851/1050170001-sd-851277.pdf; ComponentLink8Description: https://datasheet.ciiva.com/851/1050170001-sd-851277.pdf; ComponentLink9URL: https://datasheet.ciiva.com/851/1050170001-sd-851278.pdf; ComponentLink9Description: https://datasheet.ciiva.com/851/1050170001-sd-851278.pdf; ComponentLink10URL: https://datasheet.ciiva.com/30165/235271050170001-io-nectors-30165183.pdf; ComponentLink10Description: https://datasheet.ciiva.com/30165/235271050170001-io-nectors-30165183.pdf; Supplier Part Number 1: WM1399DKR-ND
J6 = CONN_HDR_1X4_V_SMT_NREC004SABC-M30RC: CONN HEADER .100" SNGL SMD 4POS; Manufacturer: Sullins; Number of Positions: 4; Connector Type: Male Pin; Pitch: 0.1inch; Supplier 1: Digi-Key; Stock 1: 875; Pricing 1: 1=0.27, 10=0.24, 100=0.1978, 500=0.15636, 1000=0.13422, 5000=0.12245, 10000=0.11774 (USD); Mount: Surface Mount; Colour: Black; Contact Plating: Tin; Package Quantity: 1; Number of Rows: 1; Packaging: Bulk; Termination: Solder; Contact Mating Length: 0.23inch; ComponentLink1URL: https://datasheet.ciiva.com/741/xrxczzzszzz-m30rc-11657-b-741121.pdf; ComponentLink1Description: https://datasheet.ciiva.com/741/xrxczzzszzz-m30rc-11657-b-741121.pdf; Supplier Part Number 1: S1013EC-04-ND
J7 = CONN_HDR_1X8_V_M_SMT_NREC008SABC-M30RC: 8 Positions Header, Unshrouded Connector 0.100" (2.54mm) Surface Mount Tin; Manufacturer: Sullins; Number of Positions: 8; Connector Type: Male Pin; Pitch: 0.1inch; Supplier 1: Digi-Key; Stock 1: 1243; Pricing 1: 1=0.36, 10=0.322, 100=0.2653, 500=0.20968, 1000=0.17999, 5000=0.1642, 10000=0.15789 (USD); Mount: Surface Mount; Colour: Black; Contact Plating: Tin; Package Quantity: 1; Number of Rows: 1; Packaging: Bulk; Termination: Solder; Contact Mating Length: 0.23inch; ComponentLink1URL: https://datasheet.ciiva.com/741/xrxczzzszzz-m30rc-11657-b-741117.pdf; ComponentLink1Description: https://datasheet.ciiva.com/741/xrxczzzszzz-m30rc-11657-b-741117.pdf; Supplier Part Number 1: S1013EC-08-ND
J9 J10 = CONN_ASSMANN_JACK_MOD_4P4C_A-2014-3-4-N-T-R: CONN MOD JACK 4P4C VERT; Shielding: Unshielded; Max Current Rating: 1.5A; Contact Resistance: 20mR; Number of Ports: 1; Number of Positions Loaded: 4; Max Voltage Rating (AC): 120V; Direction: User Selectable; Pitch: 2.54mm; Supplier 1: Digi-Key; Manufacturer: Assmann; Stock 1: 29088; Pricing 1: 1=0.55, 10=0.516, 25=0.4644, 50=0.4128, 100=0.3956, 250=0.3612, 500=0.344, 1000=0.2838, 2500=0.258 (USD); Mount: Through Hole; Contact Material: Bronze; Contact Plating: Nickel,Gold; Housing Colour: Black; Housing Material: Glass; Min Operating Temperature: -40°C; Max Operating Temperature: 85°C; Package Quantity: 130; Number of Rows: 1; Packaging: Tray; Termination: Solder; Orientation: Vertical; Connector Type: Jack; Length: 11.43mm; Depth: 16.5mm; Lead Free: Lead Free; ComponentLink1URL: http://components.arrow.com/part/dataview/0323_07027207; ComponentLink1Description: http://components.arrow.com/part/dataview/0323_07027207; ComponentLink2URL: http://www.assmann-wsw.com/fileadmin/datasheets/ASS_7331_CO.PDF; ComponentLink2Description: http://www.assmann-wsw.com/fileadmin/datasheets/ASS_7331_CO.PDF; ComponentLink3URL: http://www.assmann.us/specs/A-2014-3-4-N-T-R.pdf; ComponentLink3Description: http://www.assmann.us/specs/A-2014-3-4-N-T-R.pdf; Supplier Part Number 1: AE10393-ND
L1 = BEAD_LAIRD_MI0603J601R-10: FERRITE BEAD 600 OHM 0603; Manufacturer: Laird; Number of Lines: 1; DC Resistance (DCR): 200mR; Test Frequency: 100MHz; Supplier 1: Digi-Key; Stock 1: 1193128; Pricing 1: 1=0.18, 10=0.148, 25=0.1152, 50=0.0952, 100=0.0822, 250=0.06572, 500=0.05914, 1000=0.04929 (USD); Mount: Surface Mount; Case/Package: 0603; Weight: 0.002oz; Case Code (Metric): 1608; Case Code (Imperial): 0603; Contact Plating: Tin,Matte; Core Material: Ferrite; Material: Ferrite; Min Operating Temperature: -40°C; Max Operating Temperature: 125°C; Packaging: Tape and Reel; Package Quantity: 1; Max Current Rating: 1A; Termination: SMD/SMT; Frequency: 100MHz; Current Rating: 1A; Length: 1.6mm; Height: 0.8mm; Width: 0.031inch; Depth: 0.8mm; Lead Free: Lead Free; REACH SVHC: Unknown; ComponentLink1URL: https://datasheet.ciiva.com/3082/mi0603j601r-10-a2-vp-3082208.pdf; ComponentLink1Description: https://datasheet.ciiva.com/3082/mi0603j601r-10-a2-vp-3082208.pdf; ComponentLink2URL: https://datasheet.ciiva.com/22650/1685984-22650402.pdf; ComponentLink2Description: https://datasheet.ciiva.com/22650/1685984-22650402.pdf; ComponentLink3URL: https://datasheet.ciiva.com/1013/mi0603j601r-10-1013257.pdf; ComponentLink3Description: https://datasheet.ciiva.com/1013/mi0603j601r-10-1013257.pdf; Supplier Part Number 1: 240-2371-6-ND
LED1 LED2 = LED_RGB_SMD_CLX6F-FKC-CNP1ST1E1BB7D3D3: LED RGB IPX8 6PLCC 3.5X3.4X2.8MM; Manufacturer: Cree; Supplier 1: Digi-Key; Stock 1: 4910; Pricing 1: 1=0.32, 10=0.301, 100=0.278, 1000=0.24861 (USD); ComponentLink1URL: http://www.mouser.com/ds/2/90/CLX6F-FKC-1352-1064258.pdf; ComponentLink1Description: http://www.mouser.com/ds/2/90/CLX6F-FKC-1352-1064258.pdf; ComponentLink2URL: http://www.cree.com/led-components/media/documents/CLX6F-FKC-1352.pdf; ComponentLink2Description: http://www.cree.com/led-components/media/documents/CLX6F-FKC-1352.pdf; Supplier Part Number 1: CLX6F-FKC-CNP1ST1E1BB7D3D3DKR-ND
OPTO1 = OPTO_TOSHIBA_LOGIC_PUSHPULL_TLP2361(TPL,E: Optocoupler Logic-Out Totem-Pole DC-IN 1-CH 5-Pin SO T/R; Direction: Unidirectional; Max Power Dissipation: 20mW; Propagation Delay: 80ns; Number of Channels: 1; Output Current per Channel: 10mA; Fall Time: 0.003us; Forward Voltage: 1.5V; Supplier 1: Digi-Key; Manufacturer: Toshiba; Stock 1: 59139; Pricing 1: 1=1.21, 10=0.983, 25=0.7564, 100=0.6806, 250=0.605, 500=0.51426, 1000=0.4235 (USD); Mount: Surface Mount; Case/Package: SO; Min Operating Temperature: -40°C; Max Operating Temperature: 125°C; Packaging: Tape and Reel; Turn-On Delay Time: 80ns; Radiation Hardening: No; ComponentLink1URL: https://toshiba.semicon-storage.com/info/docget.jsp?did=14229&prodName=TLP2361; ComponentLink1Description: https://toshiba.semicon-storage.com/info/docget.jsp?did=14229&prodName=TLP2361; ComponentLink2URL: http://www.semicon.toshiba.co.jp/info/lookup.jsp?pid=TLP2361&amp;lang=en; ComponentLink2Description: http://www.semicon.toshiba.co.jp/info/lookup.jsp?pid=TLP2361&amp;lang=en; ComponentLink3URL: http://www.semicon.toshiba.co.jp/info/docget.jsp?pid=TLP2361&lang=en&type=datasheet; ComponentLink3Description: http://www.semicon.toshiba.co.jp/info/docget.jsp?pid=TLP2361&lang=en&type=datasheet; Supplier Part Number 1: TLP2361(TPLECT-ND
R1 R30-R33 R35-R37 R39-R46 R48-R55 R65 R66 = CMP-1012-00001-1: Jumper 0603 (1608 Metric); Case-Metric: 1608; Value: 0.00 Ohm; Power: None; Case-EIA: 0603; Technology: SMT; Tolerance: None
R17-R19 R27 R29 = CMP-1012-00623-1: 10K 0.1W 1% 0603 (1608 Metric)  SMD; Value: 10000.00 Ohm; Case-EIA: 0603; Case-Metric: 1608; Power: 0.1 W; Tolerance: 1 %; Technology: SMT
R28 = CMP-1012-00528-1: 1K5 0.1W 1% 0603 (1608 Metric)  SMD; Case-EIA: 0603; Value: 1500.00 Ohm; Case-Metric: 1608; Power: 0.1 W; Technology: SMT; Tolerance: 1 %
R34 R64 R75 = CMP-1012-00736-1: 100K 0.1W 1% 0603 (1608 Metric)  SMD; Value: 100000.00 Ohm; Case-Metric: 1608; Case-EIA: 0603; Power: 0.1 W; Tolerance: 1 %; Technology: SMT
R56 = CMP-1012-00463-1: 390R 0.1W 1% 0603 (1608 Metric)  SMD; Case-EIA: 0603; Case-Metric: 1608; Power: 0.1 W; Tolerance: 1 %; Technology: SMT
R67 R68 = CMP-1012-00363-1: 49R9 0.1W 1% 0603 (1608 Metric)  SMD; Case-Metric: 1608; Case-EIA: 0603; Value: 49.90 Ohm; Power: 0.1 W; Tolerance: 1 %; Technology: SMT
R69 R73 = CMP-1012-00397-1: 100R 0.1W 1% 0603 (1608 Metric)  SMD; Value: 100.00 Ohm; Case-EIA: 0603; Case-Metric: 1608; Technology: SMT; Tolerance: 1 %; Power: 0.1 W
R70 R74 = CMP-1012-00433-1: 220R 0.1W 1% 0603 (1608 Metric)  SMD; Value: 220.00 Ohm; Case-EIA: 0603; Case-Metric: 1608; Technology: SMT; Tolerance: 1 %; Power: 0.1 W
R71 R72 = CMP-1012-00086-1: 3K3 0.1W 5% 0603 (1608 Metric)  SMD; Case-EIA: 0603; Value: 3300.00 Ohm; Case-Metric: 1608; Technology: SMT; Tolerance: 5 %; Power: 0.1 W
SW1 = SWITCH_CTS_DIP_8BIT_SMD_219-8LPST: Switch DIP ON OFF SPST 8 Flush Slide 0.1A 20VDC Gull Wing 2.54mm SMD Tube; Manufacturer: CTS; Mechanical Life: 2000Cycles; Max Voltage Rating (DC): 20V; Number of Positions: 8; Current Rating: 100mA; Contact Resistance: 25mR; Pitch: 0.1inch; Washable: Yes; Supplier 1: Digi-Key; Stock 1: 16001; Pricing 1: 1=1.05, 10=1.032, 25=0.9724, 50=0.9128, 100=0.8732, 250=0.83348, 500=0.75412, 1000=0.69458, 5000=0.56558 (USD); Mount: Surface Mount; Contact Plating: Tin,Gold; Contact Material: Copper; Min Operating Temperature: -55°C; Max Operating Temperature: 85°C; Throw Configuration: SPST; Termination: Gull Wing; Voltage Rating (DC): 20V; Life (Cycles): 2000Cycles; Packaging: Rail/Tube; Package Quantity: 25; Electrical Life: 2000Cycles; Max Current Rating: 100mA; Orientation: Straight; Length: 0.858inch; Height: 4.05mm; Terminal Pitch: 2.54mm; Depth: 9.91mm; Radiation Hardening: No; ComponentLink1URL: https://datasheet.ciiva.com/15184/getdatasheetpartid-151166-15184869.pdf; ComponentLink1Description: https://datasheet.ciiva.com/15184/getdatasheetpartid-151166-15184869.pdf; ComponentLink2URL: https://datasheet.ciiva.com/19471/859667-19471590.pdf; ComponentLink2Description: https://datasheet.ciiva.com/19471/859667-19471590.pdf; ComponentLink3URL: https://datasheet.ciiva.com/2863/219-2863549.pdf; ComponentLink3Description: https://datasheet.ciiva.com/2863/219-2863549.pdf; ComponentLink4URL: https://datasheet.ciiva.com/16316/219-16316175.pdf; ComponentLink4Description: https://datasheet.ciiva.com/16316/219-16316175.pdf; Supplier Part Number 1: CT2198LPST-ND
SW2-SW4 = SWITCH_CK_TACTILE_SPST_SMD_PTS645SM43SMTR92LFS: SWITCH TACTILE SPST-NO 0.05A 12V; Manufacturer: ITT C&K; Mechanical Life: 100000Cycles; Actuator Material: Nylon,Polyamide; Throw Configuration: SPST; Contact Resistance: 100mR; Operating Force: 160gf; Max Current Rating: 50mA; Illumination Type: Non-Illuminated,Illuminated; Switch Function: Off-Mom; Actuator Length: 0.85mm; Supplier 1: Digi-Key; Stock 1: 313002; Pricing 1: 1=0.16, 10=0.157, 25=0.1516, 50=0.1462, 100=0.1381, 250=0.12996, 500=0.12452 (USD); Mount: Surface Mount; Case/Package: SMD/SMT; Contact Plating: Silver; Contact Material: Silver; Colour: Black; Min Operating Temperature: -20°C; Max Operating Temperature: 60°C; Max Voltage Rating (DC): 12V; Packaging: Tape and Reel; Package Quantity: 1000; Current Rating: 50mA; Voltage Rating (DC): 12V; Termination: Gull Wing; Orientation: Straight; Length: 6mm; Depth: 9mm; REACH SVHC: No SVHC; Lead Free: Lead Free; ComponentLink1URL: https://datasheet.ciiva.com/29903/getdatasheetpartid-786341-29903846.pdf; ComponentLink1Description: https://datasheet.ciiva.com/29903/getdatasheetpartid-786341-29903846.pdf; ComponentLink2URL: https://datasheet.ciiva.com/14920/pts645-14920733.pdf; ComponentLink2Description: https://datasheet.ciiva.com/14920/pts645-14920733.pdf; ComponentLink3URL: https://datasheet.ciiva.com/14920/pts645-14920734.pdf; ComponentLink3Description: https://datasheet.ciiva.com/14920/pts645-14920734.pdf; ComponentLink4URL: https://datasheet.ciiva.com/14920/pts645-14920735.pdf; ComponentLink4Description: https://datasheet.ciiva.com/14920/pts645-14920735.pdf; ComponentLink5URL: https://datasheet.ciiva.com/29931/getdatasheetpartid-764615-29931183.pdf; ComponentLink5Description: https://datasheet.ciiva.com/29931/getdatasheetpartid-764615-29931183.pdf; Supplier Part Number 1: CKN9112DKR-ND
TP2 TP4-TP7 TP15 = TEST_POINT_KEYSTONE_5019_SMT: Circuit Board Hardware - PCB TEST POINT; Manufacturer: Keystone Electronics; Supplier 1: Digi-Key; Stock 1: 207442; Pricing 1: 1=0.38, 10=0.355, 25=0.3044, 50=0.2586, 100=0.2485, 250=0.22316, 500=0.21302 (USD); Mount: Surface Mount,PCB; Number of Pins: 1; Contact Plating: Silver; Material: Bronze; Contact Material: Bronze; Packaging: Tape and Reel; Package Quantity: 1; Termination: SMD/SMT; Height: 0.09inch; REACH SVHC: No SVHC; Lead Free: Lead Free; ComponentLink1URL: https://datasheet.ciiva.com/14848/m60-2p61-14848437.pdf; ComponentLink1Description: https://datasheet.ciiva.com/14848/m60-2p61-14848437.pdf; ComponentLink2URL: https://datasheet.ciiva.com/14848/m60-2p61-14848438.pdf; ComponentLink2Description: https://datasheet.ciiva.com/14848/m60-2p61-14848438.pdf; ComponentLink3URL: https://datasheet.ciiva.com/14848/m60-2p61-14848439.pdf; ComponentLink3Description: https://datasheet.ciiva.com/14848/m60-2p61-14848439.pdf; ComponentLink4URL: https://datasheet.ciiva.com/16885/70182998-16885945.pdf; ComponentLink4Description: https://datasheet.ciiva.com/16885/70182998-16885945.pdf; ComponentLink5URL: https://datasheet.ciiva.com/16318/m60-2p61-16318395.pdf; ComponentLink5Description: https://datasheet.ciiva.com/16318/m60-2p61-16318395.pdf; Supplier Part Number 1: 36-5019CT-ND
U2 = IC_PROCESSOR_STM_STM32F765BIT6_LQFP208: IC MCU 32BIT 2MB FLASH 208LQFP; Manufacturer: STMicroelectronics; ComponentLink1Description: Manufacturer URL; ComponentLink1URL: http://www.st.com/web/en/home.html; ComponentLink2URL: http://www.st.com/st-web-ui/static/active/en/resource/technical/document/datasheet/DM00166116.pdf; ComponentLink3Description: Package Specification; ComponentLink3URL: http://www.st.com/st-web-ui/static/active/en/resource/technical/document/data_brief/DM00053488.pdf; ComponentLink2Description: Datasheet; Supplier 1: Digi-Key; Stock 1: 513; Pricing 1: 1=16.49, 10=15.151, 100=12.7955, 500=11.3825 (USD); ComponentLink4URL: http://www.st.com/content/ccc/resource/technical/document/reference_manual/group0/96/8b/0d/ec/16/22/43/71/DM00224583/files/DM00224583.pdf/jcr:content/translations/en.DM00224583.pdf; ComponentLink4Description: http://www.st.com/content/ccc/resource/technical/document/reference_manual/group0/96/8b/0d/ec/16/22/43/71/DM00224583/files/DM00224583.pdf/jcr:content/translations/en.DM00224583.pdf; Supplier Part Number 1: 497-16623-ND; Manufacturer Part Number: STM32F765BIT6
U5 = LOGIC_INVERTER_SN74LVC1G14DBVR: IC SCHMITT TRIG INV SOT-23-5; Manufacturer: Texas Instruments; Propagation Delay: 11ns; Max Supply Voltage: 5.5V; Min Supply Voltage: 1.65V; Output Current: 32mA; Number of Inputs: 1; Logic Function: Schmitt Trigger,Buffer,Inverter; Quiescent Current: 10uA; High Level Output Current: -32mA; Supplier 1: Digi-Key; Stock 1: 173974; Pricing 1: 1=0.43, 10=0.32, 100=0.1996, 500=0.13658, 1000=0.10506 (USD); Mount: Surface Mount; Case/Package: SOT-23; Number of Pins: 5; Weight: 0.000557oz; Contact Plating: Tin,Matte; Min Operating Temperature: -40°C; Max Operating Temperature: 125°C; Packaging: Tape and Reel; Max Output Current: 32mA; Package Quantity: 3000; Number of Elements: 1; Number of Circuits: 1; Low Level Output Current: 32mA; Turn-On Delay Time: 11ns; Termination: SMD/SMT; Number of Gates: 1; Number of Bits: 1; Radiation Hardening: No; REACH SVHC: No SVHC; Lead Free: Lead Free; ComponentLink1URL: https://datasheet.ciiva.com/28540/1772446-28540802.pdf; ComponentLink1Description: https://datasheet.ciiva.com/28540/1772446-28540802.pdf; ComponentLink2URL: https://datasheet.ciiva.com/4219/1096sn74lvc1g14-4219459.pdf; ComponentLink2Description: https://datasheet.ciiva.com/4219/1096sn74lvc1g14-4219459.pdf; ComponentLink3URL: https://datasheet.ciiva.com/1864/sn74lvc1g14-1864164.pdf; ComponentLink3Description: https://datasheet.ciiva.com/1864/sn74lvc1g14-1864164.pdf; ComponentLink4URL: https://datasheet.ciiva.com/1864/sn74lvc1g14-1864165.pdf; ComponentLink4Description: https://datasheet.ciiva.com/1864/sn74lvc1g14-1864165.pdf; ComponentLink5URL: https://datasheet.ciiva.com/1864/sn74lvc1g14-1864166.pdf; ComponentLink5Description: https://datasheet.ciiva.com/1864/sn74lvc1g14-1864166.pdf; ComponentLink6URL: https://datasheet.ciiva.com/34301/1044161-34301915.pdf; ComponentLink6Description: https://datasheet.ciiva.com/34301/1044161-34301915.pdf; ComponentLink7URL: https://datasheet.ciiva.com/15089/getdatasheetpartid-204107-15089388.pdf; ComponentLink7Description: https://datasheet.ciiva.com/15089/getdatasheetpartid-204107-15089388.pdf; ComponentLink8URL: https://datasheet.ciiva.com/7783/1768049-7783597.pdf; ComponentLink8Description: https://datasheet.ciiva.com/7783/1768049-7783597.pdf; ComponentLink9URL: https://datasheet.ciiva.com/14290/sn74lvc1g14-14290317.pdf; ComponentLink9Description: https://datasheet.ciiva.com/14290/sn74lvc1g14-14290317.pdf; ComponentLink10URL: https://datasheet.ciiva.com/16502/sn74lvc1g14-16502797.pdf; ComponentLink10Description: https://datasheet.ciiva.com/16502/sn74lvc1g14-16502797.pdf; ComponentLink11URL: https://datasheet.ciiva.com/26042/sn74lvc1g14-26042397.pdf; ComponentLink11Description: https://datasheet.ciiva.com/26042/sn74lvc1g14-26042397.pdf; ComponentLink12URL: https://datasheet.ciiva.com/7783/1768049-7783598.pdf; ComponentLink12Description: https://datasheet.ciiva.com/7783/1768049-7783598.pdf; ComponentLink13URL: https://datasheet.ciiva.com/48703/001074513-da-01-en-ic-schmitt-sn74lvc1g14dbvr-sot-23-5-tid-48703804.pdf; ComponentLink13Description: https://datasheet.ciiva.com/48703/001074513-da-01-en-ic-schmitt-sn74lvc1g14dbvr-sot-23-5-tid-48703804.pdf; Supplier Part Number 1: 296-11607-6-ND
U7 = EEPROM_I2C_2KB_MAC_24AA02E64T-I/OT: IC EEPROM 2KBIT 400KHZ SOT23-5; Manufacturer: Microchip; Density: 2Kb; Nominal Supply Current: 3mA; Min Supply Voltage: 1.7V; Max Supply Voltage: 5.5V; Interface: I2C,Serial,2-Wire; Access Time: 3500ns; Number of Words: 128; Supplier 1: Digi-Key; Stock 1: 16996; Pricing 1: 1=0.23, 25=0.2164, 100=0.2119 (USD); Case/Package: SOT-23; Number of Pins: 5; Contact Plating: Tin,Matte; Min Operating Temperature: -40°C; Max Operating Temperature: 85°C; Frequency: 400kHz; Package Quantity: 3000; Packaging: Tape and Reel; Memory Type: EEPROM; Memory Size: 2Kb; Max Frequency: 400kHz; Length: 3.1mm; Height: 1.3mm; Width: 1.8mm; Radiation Hardening: No; REACH SVHC: No SVHC; Lead Free: Lead Free; ComponentLink1URL: https://datasheet.ciiva.com/24021/20002124e-24021936.pdf; ComponentLink1Description: https://datasheet.ciiva.com/24021/20002124e-24021936.pdf; ComponentLink2URL: https://datasheet.ciiva.com/24009/20002124e-24009098.pdf; ComponentLink2Description: https://datasheet.ciiva.com/24009/20002124e-24009098.pdf; ComponentLink3URL: https://datasheet.ciiva.com/30478/0900766b8127facf-30478074.pdf; ComponentLink3Description: https://datasheet.ciiva.com/30478/0900766b8127facf-30478074.pdf; ComponentLink4URL: https://datasheet.ciiva.com/22692/1725195-22692205.pdf; ComponentLink4Description: https://datasheet.ciiva.com/22692/1725195-22692205.pdf; Supplier Part Number 1: 24AA02E64T-I/OTDKR-ND
X1 = XTAL_8MHz_4SMD_18PF_20PPM_ECS-80-18-30B-JEM-TR: 8MHz ±20ppm Crystal 18pF 100 Ohm -20°C ~ 70°C  Surface Mount 4-SMD, No Lead (DFN, LCC); Manufacturer: ECS International; ESR (Equivalent Series Resistance): 100R; Frequency Stability: 50ppm; Supplier 1: Digi-Key; Stock 1: 975; Pricing 1: 1=0.78, 10=0.69, 50=0.645, 100=0.57, 500=0.54 (USD); Mount: Surface Mount; Case/Package: SMD/SMT; Min Operating Temperature: -20°C; Max Operating Temperature: 70°C; Packaging: Tape and Reel; Length: 0.197inch; Height: 0.033inch; Width: 0.126inch; ComponentLink1URL: http://www.ecsxtal.com/store/pdf/ecx_53b.pdf; ComponentLink1Description: http://www.ecsxtal.com/store/pdf/ecx_53b.pdf; ComponentLink2URL: http://www.mouser.com/ds/2/122/ecx_53b-15555.pdf; ComponentLink2Description: http://www.mouser.com/ds/2/122/ecx_53b-15555.pdf; Supplier Part Number 1: XC2105CT-ND